# Altium schematic sheet ENC.SchDoc
size A
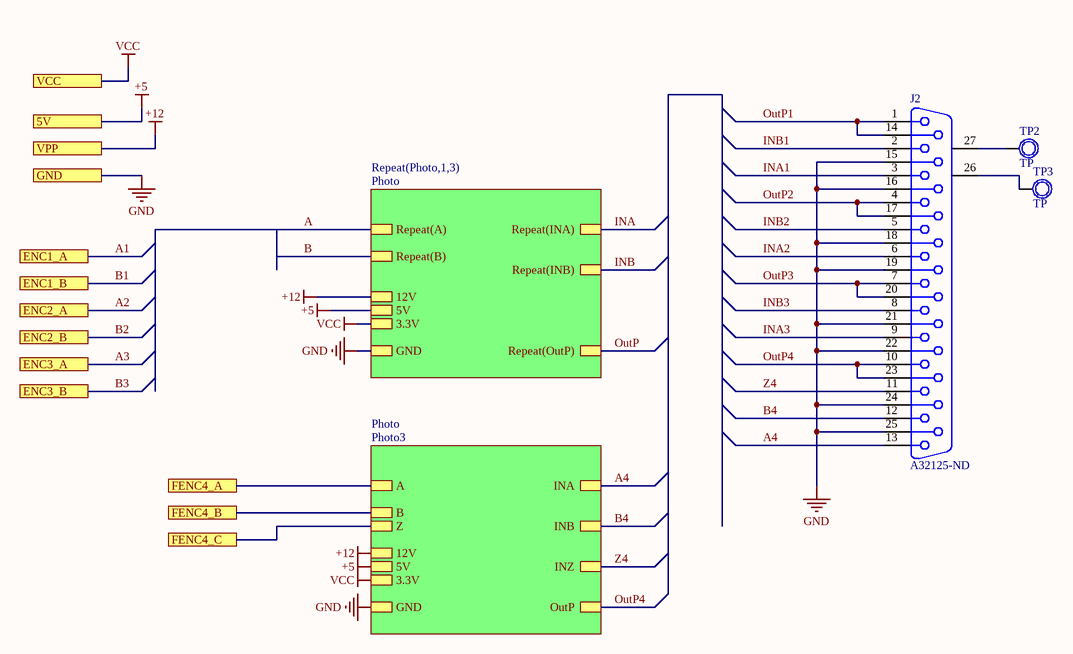
[diagram p0: ENC.SchDoc]

## Parts
J2  A32125-ND  [DB25]
TP2  TP  [TP1]
TP3  TP  [TP1]

## Sub-sheets
Photo = Photo3: B, A, INB, INA, 12V, 5V, 3.3V, GND, Z, INZ, OutP
Repeat(Photo,1,3) = Photo: Repeat(B), Repeat(A), Repeat(INB), Repeat(INA), 12V, 5V, 3.3V, GND, Repeat(OutP)

## Ports
5V, ENC1_A, ENC1_B, ENC2_A, ENC2_B, ENC3_A, ENC3_B, FENC4_A, FENC4_B, FENC4_C, GND, VCC, VPP

## Nets
+5: port 5V, sheet Repeat(Photo,1,3)/5V, sheet Photo/5V
+12: port VPP, sheet Repeat(Photo,1,3)/12V, sheet Photo/12V
GND: J2.15 J2.16 J2.18 J2.19 J2.21 J2.22 J2.24 J2.25 ; port GND, sheet Repeat(Photo,1,3)/GND, sheet Photo/GND
VCC: port VCC, sheet Repeat(Photo,1,3)/3.3V, sheet Photo/3.3V
A: sheet Repeat(Photo,1,3)/Repeat(A)
A1: port ENC1_A
A2: port ENC2_A
A3: port ENC3_A
A4: J2.13 ; sheet Photo/INA
B: sheet Repeat(Photo,1,3)/Repeat(B)
B1: port ENC1_B
B2: port ENC2_B
B3: port ENC3_B
B4: J2.12 ; sheet Photo/INB
FENC4_A: port FENC4_A, sheet Photo/A
FENC4_B: port FENC4_B, sheet Photo/B
FENC4_C: port FENC4_C, sheet Photo/Z
INA: sheet Repeat(Photo,1,3)/Repeat(INA)
INA1: J2.3
INA2: J2.6
INA3: J2.9
INB: sheet Repeat(Photo,1,3)/Repeat(INB)
INB1: J2.2
INB2: J2.5
INB3: J2.8
OutP: sheet Repeat(Photo,1,3)/Repeat(OutP)
OutP1: J2.1 J2.14
OutP2: J2.4 J2.17
OutP3: J2.7 J2.20
OutP4: J2.10 J2.23 ; sheet Photo/OutP
Z4: J2.11 ; sheet Photo/INZ
NetJ2_26: J2.26(MH1) TP3.1
NetJ2_27: J2.27(MH2) TP2.1

## Library data of the parts
J2 = DB25: Receptacle Assembly, Size 3, 25 Position, Right Angle, .318 Series, Amplimite; Positions: 25; MatingConnector: 4-40 Threaded Insert; PCB_Layout: Complies with manufacturer's recommendation.; DrillSize: Corresponds to nominal value.; ComponentAvailability: Obsolete; Published: 15-Jun-2001; LatestRevisionDate: 17-Jul-2002; LatestRevisionNote: Re-released for DXP Platform.; DatasheetDocument: 19-Mar-1999; PackageDocument: 19-Mar-1999; PackageReference: 787202-4; Publisher: Altium Limited; Orientation: Right Angle; Gender: Receptacle; ShellSize: 3; ComponentLink1Description: Manufacturer Link; ComponentLink1URL: http://www.tycoelectronics.com/
TP2 TP3 = TP1: Test Point; Value: Test Point